# Altium schematic sheet rs485.SchDoc
size A2; SheetNumber: 8; SheetTotal: 9
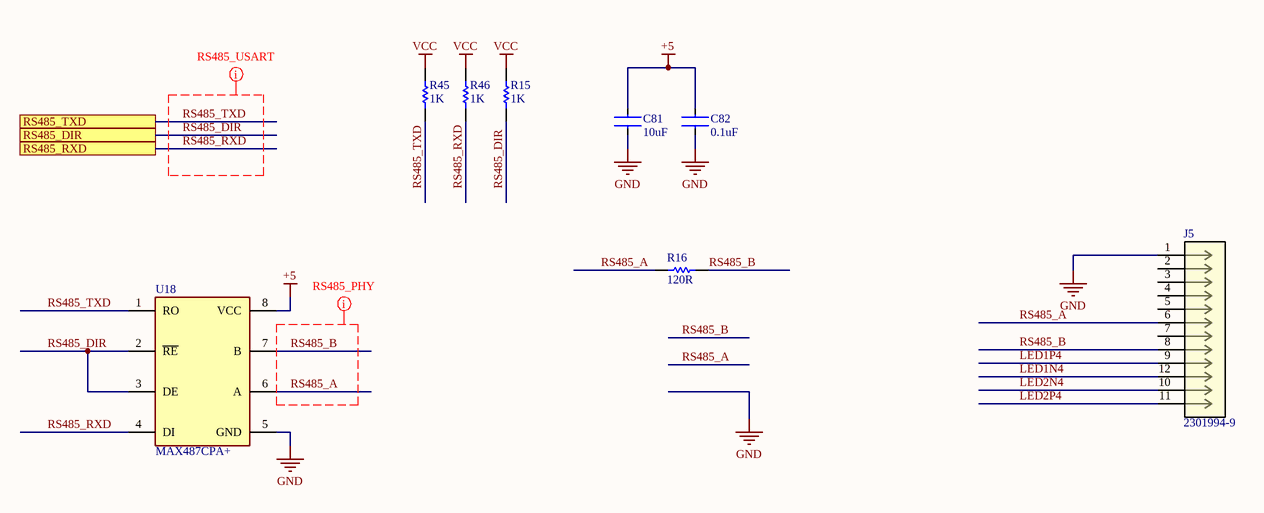
[diagram p0: rs485.SchDoc]

## Parts
C81  10uF  [C0402]
C82  0.1uF  [C0402]
J5  2301994-9  [CONN12_2301994-9_TEC]
R15  1K  [R0402]
R16  120R  [R0402]
R45  1K  [R0402]
R46  1K  [R0402]
U18  MAX487CPA+  [SOIC-8]

## Ports
RS485_DIR, RS485_RXD, RS485_TXD

## Nets
+5: C81.1 C82.1 U18.8(VCC)
GND: C81.2 C82.2 J5.1 U18.5(GND)
VCC: R15.2 R45.2 R46.2
LED1N4: J5.12
LED1P4: J5.9
LED2N4: J5.10
LED2P4: J5.11
RS485_A: J5.6 R16.1 U18.6(A)
RS485_B: J5.8 R16.2 U18.7(B)
RS485_DIR: R15.1 U18.2(~{RE}) U18.3(DE) ; port RS485_DIR
RS485_RXD: R46.1 U18.4(DI) ; port RS485_RXD
RS485_TXD: R45.1 U18.1(RO) ; port RS485_TXD

Not connected (* = marked no-connect by the designer): J5 2 3 4 5 7

## Layout directives
mark named RS485_PHY: RS485_A, RS485_B
mark named RS485_USART: RS485_DIR, RS485_RXD, RS485_TXD

## Notes on the sheet
- CONFIDENTAL. Do not distribute.
- Page Contents:
- Title:
- Company
- Logo
- Date:
- SIZE:
- A2
- DWG Num:
- Time:
- Variant:
- Sheet
- Revision:
- of
- Drawn by:
- Checked by:

## Library data of the parts
C81 = CL31B106KOHNNNE: Cap Ceramic 10uF 16V X7R 10% Pad SMD 1206 125°C T/R; Manufacturer: Samsung; Supplier 1: Future Electronics; Manufacturer Part Number: CL31B106KOHNNNE; RoHS: Yes; Category: Ceramic Capacitors; Stock 1: 116000; Pricing 1: 2000=0.03800, 6000=0.03460, 8000=0.03450, 20000=0.03420, 30000=0.03400 (USD); Mount: Surface Mount; Case/Package: 1206; Case Code (Metric): 3216; Case Code (Imperial): 1206; Material: Ceramic; Contact Plating: Tin; Min Operating Temperature: -55°C; Max Operating Temperature: 125°C; Capacitance: 10uF; Tolerance: 10%; Dielectric: X7R; Package Quantity: 1; Packaging: Tape and Reel; Voltage Rating: 16V; Series: CL; Length: 3.2mm; Width: 0.063inch; Height: 1.6mm; Thickness: 0.071inch; Depth: 1.6mm; RoHS Compliant: Yes; ComponentLink1URL: https://datasheet.ciiva.com/25795/cl31b106kohnnne-25795201.pdf?src-supplier=Digi-Key; ComponentLink1Description: https://datasheet.ciiva.com/25795/cl31b106kohnnne-25795201.pdf?src-supplier=Digi-Key; ComponentLink2URL: https://datasheet.ciiva.com/29201/452535-da-01-en-vs-kondensator-1206-29201132.pdf?src-supplier=Conrad; ComponentLink2Description: https://datasheet.ciiva.com/29201/452535-da-01-en-vs-kondensator-1206-29201132.pdf?src-supplier=Conrad; Supplier Part Number 1: 2558872
C82 = CL31B104KBCNNNC: Ceramic capacitor SMD-1206 100nF /50V X7R# K +-10%, Samsung, RoHS; Tolerance: 10%; Dielectric: X7R; Voltage: 50V; Supplier 1: Arrow Electronics; Manufacturer: Samsung; Manufacturer Part Number: CL31B104KBCNNNC; RoHS: Yes; Category: Ceramic Capacitors; Stock 1: 3508000; Pricing 1: 4000=0.02060, 8000=0.01660 (USD); Mount: Surface Mount; Case/Package: 1206; Case Code (Metric): 3216; Case Code (Imperial): 1206; Material: Ceramic; Contact Plating: Tin; Min Operating Temperature: -55°C; Max Operating Temperature: 125°C; Capacitance: 100nF; Voltage Rating (DC): 50V; Packaging: Tape and Reel; Voltage Rating: 50V; Series: CL; Length: 3.2mm; Width: 0.063inch; Height: 0.85mm; Depth: 1.6mm; Thickness: 0.037inch; Radiation Hardening: No; Lead Free: Lead Free; RoHS Compliant: Yes; ComponentLink1URL: https://datasheet.ciiva.com/25710/cl31b104kbcnnnc-25710293.pdf?src-supplier=Digi-Key; ComponentLink1Description: https://datasheet.ciiva.com/25710/cl31b104kbcnnnc-25710293.pdf?src-supplier=Digi-Key; ComponentLink2URL: https://datasheet.ciiva.com/29201/451941-da-01-en-vs-kondensator-1206-29201689.pdf?src-supplier=Conrad; ComponentLink2Description: https://datasheet.ciiva.com/29201/451941-da-01-en-vs-kondensator-1206-29201689.pdf?src-supplier=Conrad; ComponentLink3URL: https://datasheet.ciiva.com/16298/cl05b104kq5nnnc-16298186.pdf?src-supplier=Future+Electronics; ComponentLink3Description: https://datasheet.ciiva.com/16298/cl05b104kq5nnnc-16298186.pdf?src-supplier=Future+Electronics; Supplier Part Number 1: CL31B104KBCNNNC
J5 = 2301994-9: No Description Available; Mfr_Name: TE Connectivity; Copyright: Copyright (C) 2022 Ultra Librarian. All rights reserved.; Manufacturer_Part_Number: 2301994-9; RefDes: RefDes; Type: DEV
R15 R45 R46 = RC1206FR-071KL: In a Pack of 5000, 1K 1206 Thick Film SMD Resistor ±1% 0.25W - RC1206FR-071KL; Manufacturer: Yageo; Resistance: 1kR; Power Rating: 250mW; Voltage Rating: 200V; Temperature Coefficient: 100ppm/°C; Supplier 1: Arrow Electronics; Manufacturer Part Number: RC1206FR-071KL; RoHS: Yes; Category: Chip SMD Resistors; Stock 1: 535000; Pricing 1: 5000=0.00940, 10000=0.00890 (USD); Case/Package: 1206; Case Code (Imperial): 1206; Case Code (Metric): 3216; Size Code: 1206; Min Operating Temperature: -55°C; Max Operating Temperature: 155°C; Tolerance: 1%; Packaging: Tape and Reel; Resistor Type: Thick Film; Termination: SMD/SMT; Series: RC; Resistance Tolerance: 1%; Construction: Rectangular; Technology: THICK FILM; Length: 3.1mm; Height: 0.55mm; Depth: 1.6mm; REACH SVHC: Unknown; Military Standard: Not; Lead Free: Lead Free; RoHS Compliant: Yes; ComponentLink1URL: https://datasheet.ciiva.com/11808/0900766b80c6630a-11808217.pdf?src-supplier=RSComponents; ComponentLink1Description: https://datasheet.ciiva.com/11808/0900766b80c6630a-11808217.pdf?src-supplier=RSComponents; ComponentLink2URL: https://datasheet.ciiva.com/29181/402540-da-01-en-smd-widerstand-chip1206-1-kohm-29181462.pdf?src-supplier=Conrad; ComponentLink2Description: https://datasheet.ciiva.com/29181/402540-da-01-en-smd-widerstand-chip1206-1-kohm-29181462.pdf?src-supplier=Conrad; ComponentLink3URL: https://datasheet.ciiva.com/46445/444357-46445708.pdf?src-supplier=Element14; ComponentLink3Description: https://datasheet.ciiva.com/46445/444357-46445708.pdf?src-supplier=Element14; Supplier Part Number 1: RC1206FR-071KL
R16 = RC1206FR-07120RL: Res Thick Film 1206 120 Ohm 1% 0.25W(1/4W) ±100ppm/°C Pad SMD T/R; Manufacturer: Yageo; Power Rating: 250mW; Voltage Rating: 200V; Supplier 1: Arrow Electronics; Manufacturer Part Number: RC1206FR-07120RL; RoHS: Yes; Category: Chip SMD Resistors; Stock 1: 1086; Pricing 1: 1=0.07410, 10=0.04680, 25=0.03250, 100=0.02110, 250=0.02080, 500=0.02000, 1000=0.01370 (USD); Case/Package: 1206; Case Code (Imperial): 1206; Case Code (Metric): 3216; Size Code: 1206; Min Operating Temperature: -55°C; Max Operating Temperature: 155°C; Resistance: 120R; Tolerance: 1%; Packaging: Tape and Reel; Resistor Type: Thick Film; Temperature Coefficient: 100ppm/°C; Package Quantity: 5000; Termination: SMD/SMT; Features: Moisture Resistant; Series: RC; Max Power Dissipation: 250mW; Number of Terminations: 2; Resistance Tolerance: 1%; Technology: THICK FILM; Length: 3.1mm; Width: 1.6mm; Height: 0.55mm; Depth: 1.6mm; REACH SVHC: Unknown; Lead Free: Lead Free; RoHS Compliant: Yes; ComponentLink1URL: https://datasheet.ciiva.com/11819/0900766b80c6630a-11819893.pdf?src-supplier=RSComponents; ComponentLink1Description: https://datasheet.ciiva.com/11819/0900766b80c6630a-11819893.pdf?src-supplier=RSComponents; ComponentLink2URL: https://datasheet.ciiva.com/7857/444357-7857253.pdf?src-supplier=Element14; ComponentLink2Description: https://datasheet.ciiva.com/7857/444357-7857253.pdf?src-supplier=Element14; ComponentLink3URL: https://datasheet.ciiva.com/16746/pyu-rc1206-51-rohs-l-4-16746171.pdf?src-supplier=Future+Electronics; ComponentLink3Description: https://datasheet.ciiva.com/16746/pyu-rc1206-51-rohs-l-4-16746171.pdf?src-supplier=Future+Electronics; Supplier Part Number 1: RC1206FR-07120RL
U18 = MAX487ECPA+: Interface IC RS422/485 DIL-8, MAX487ECPA+, Maxim; Operating Supply Voltage: 5V; Number of Transmitters: 1; Logic Function: Transceiver; Data Rate: 256Kbps; Max Power Dissipation: 727mW; Output Voltage: 3V; Propagation Delay: 250ns; Max Supply Voltage: 5.25V; Min Supply Voltage: 4.75V; Nominal Supply Current: 250uA; Interface: RS-422,RS-485; Simplex/Duplex: Half Duplex; Supplier 1: Digi-Key; Manufacturer: Maxim; Manufacturer Part Number: MAX487ECPA+; RoHS: Yes; Category: Interface ICs; Stock 1: 285; Pricing 1: 1=4.05000, 10=3.63500, 25=3.43680, 100=3.05500 (USD); Mount: Through Hole; Case/Package: DIP; Number of Pins: 8; Min Operating Temperature: 0°C; Max Operating Temperature: 70°C; Packaging: Rail/Tube; Package Quantity: 50; Number of Receivers: 1; Number of Transceivers: 1; Series: -; Number of Drivers: 1; Supply Current: 250uA; Length: 9.91mm; Width: 7.87mm; Height: 4.45mm; Radiation Hardening: No; Lead Free: Lead Free; RoHS Compliant: Yes; REACH SVHC: No SVHC; ComponentLink1URL: https://datasheet.ciiva.com/16973/0900766b8078aed8-16973392.pdf?src-supplier=Allied+Electronics; ComponentLink1Description: https://datasheet.ciiva.com/16973/0900766b8078aed8-16973392.pdf?src-supplier=Allied+Electronics; ComponentLink2URL: https://datasheet.ciiva.com/16640/max1487e-max491e-16640614.pdf?src-supplier=Avnet+Europe; ComponentLink2Description: https://datasheet.ciiva.com/16640/max1487e-max491e-16640614.pdf?src-supplier=Avnet+Europe; ComponentLink3URL: https://datasheet.ciiva.com/8075/3976-8075401.pdf?src-supplier=Element14; ComponentLink3Description: https://datasheet.ciiva.com/8075/3976-8075401.pdf?src-supplier=Element14; ComponentLink4URL: https://datasheet.ciiva.com/14430/max1487e-max491e-14430329.pdf?src-supplier=Avnet; ComponentLink4Description: https://datasheet.ciiva.com/14430/max1487e-max491e-14430329.pdf?src-supplier=Avnet; ComponentLink5URL: https://datasheet.ciiva.com/14152/jxmax481e-491e-e-14152719.pdf?src-supplier=Distrelec; ComponentLink5Description: https://datasheet.ciiva.com/14152/jxmax481e-491e-e-14152719.pdf?src-supplier=Distrelec; ComponentLink6URL: https://datasheet.ciiva.com/1713/max1487e-max491e-1713146.pdf?src-supplier=Digi-Key; ComponentLink6Description: https://datasheet.ciiva.com/1713/max1487e-max491e-1713146.pdf?src-supplier=Digi-Key; ComponentLink7URL: https://datasheet.ciiva.com/4785/max1487e-max491e-4785914.pdf?src-supplier=Mouser; ComponentLink7Description: https://datasheet.ciiva.com/4785/max1487e-max491e-4785914.pdf?src-supplier=Mouser; Supplier Part Number 1: MAX487ECPA+-ND